# Altium schematic sheet LDO_3V3.SchDoc
size A4; SheetNumber: 4; SheetTotal: 8
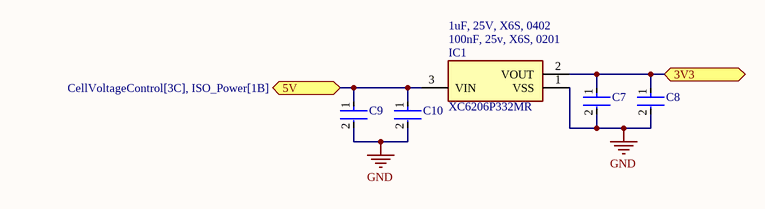
[diagram p0: LDO_3V3.SchDoc]

## Parts
C7  100nF, 25v, X6S, 0201  [FP-GRM033-0_03-IPC_B]  (value not drawn)
C8  1uF, 25V, X6S, 0402  [FP-GRT155-0_1-IPC_A]  (value not drawn)
C9  1uF, 25V, X6S, 0402  [FP-GRT155-0_1-IPC_A]  (value not drawn)
C10  100nF, 25v, X6S, 0201  [FP-GRM033-0_03-IPC_B]  (value not drawn)
IC1  XC6206P332MR  [SOT95P280X130-3N]

## Ports
3V3 (bidir, see CellVoltageControl[3C], MCU[1A], MCU[4A], MCU[4B]), 5V (bidir, see CellVoltageControl[3C], ISO_Power[1B])

## Nets
GND: C7.2 C8.2 C9.2 C10.2 IC1.1(VSS)
3V3: C7.1 C8.1 IC1.2(VOUT) ; port 3V3
5V: C9.1 C10.1 IC1.3(VIN) ; port 5V

## Notes on the sheet
- (near IC1) 100nF, 25v, X6S, 0201
- (near IC1) 1uF, 25V, X6S, 0402

## Library data of the parts
C7 C10 = CMP-06035-023320-1: Chip Multilayer Ceramic Capacitors for General Purpose, 0201, 0.10uF, X6S, 22%, 10%, 25V; Height: 0.3mm; Width: 0.3mm; Weight: 1.2E-05oz; Min Operating Temperature: -55°C; Dielectric: X6S; Packaging: Tape and Reel; Tolerance: 10%; Mount: Surface Mount; Case Code (Imperial): 0201; Case/Package: 0201; Max Operating Temperature: 105°C; Case Code (Metric): 0603; Voltage Rating: 25V; Capacitance: 100nF; Package Quantity: 15000; Thickness: 0.013inch; Length: 0.024inch; Termination: SMD/SMT; Voltage Rating (DC): 25V
C8 C9 = CMP-06035-047663-1: Multi-Layer Ceramic Capacitor 1uF 25V X6S ±10% 0402 Paper T/R
IC1 = XC6206P332MR: Integrated Circuit; Manufacturer_Name: Torex; Datasheet Link: http://www.torexsemi.com/products/voltage_regulators/data/XC6206.pdf; Height: 1.3mm; Manufacturer_Part_Number: XC6206P332MR; Mouser Part Number: N/A; Mouser Price/Stock: https://www.mouser.co.uk/ProductDetail/Torex-Semiconductor/XC6206P332MR?qs=TiOZkKH1s2Qxu69VLzzkSQ%3D%3D